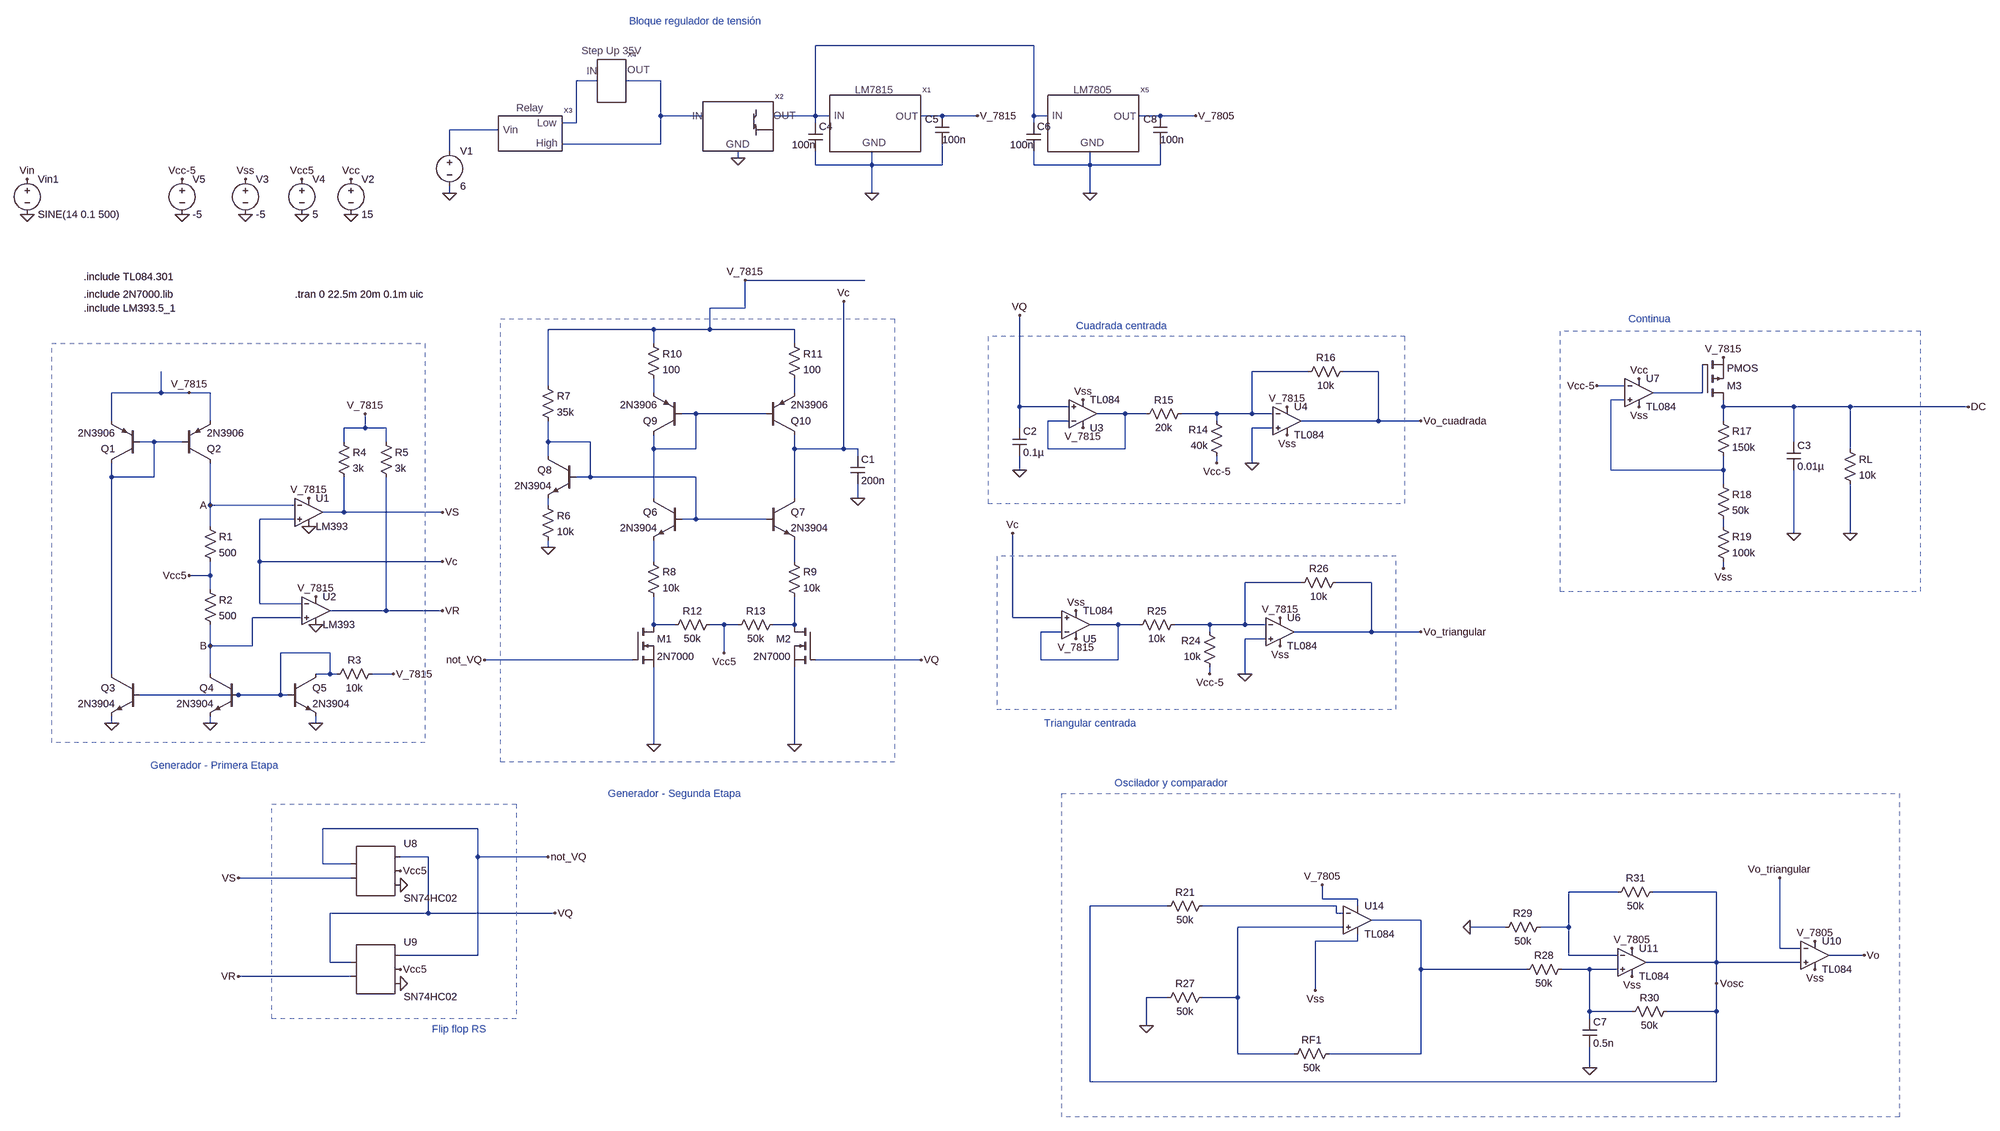
[diagram p0: schematic PWM.asc]
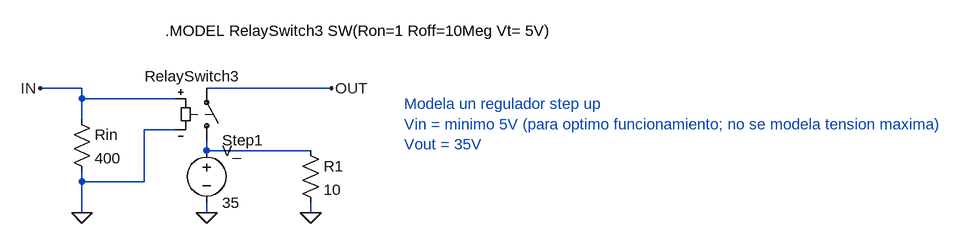
[diagram p1: sub-circuit stepup_ideal.asc]
PWM.asc, the LTspice schematic file:
Version 4
SHEET 1 4360 2064
WIRE 1584 -832 1088 -832
WIRE 592 -752 544 -752
WIRE 736 -752 656 -752
WIRE 736 -672 736 -752
WIRE 832 -672 736 -672
WIRE 1088 -672 1088 -832
WIRE 1088 -672 992 -672
WIRE 1120 -672 1088 -672
WIRE 1376 -672 1328 -672
WIRE 1456 -672 1376 -672
WIRE 1584 -672 1584 -832
WIRE 1616 -672 1584 -672
WIRE 1872 -672 1824 -672
WIRE 1952 -672 1872 -672
WIRE 544 -656 544 -752
WIRE 544 -656 512 -656
WIRE 1088 -656 1088 -672
WIRE 1584 -656 1584 -672
WIRE 368 -640 256 -640
WIRE 736 -608 736 -672
WIRE 736 -608 512 -608
WIRE 256 -592 256 -640
WIRE 912 -576 912 -592
WIRE 1088 -560 1088 -592
WIRE 1216 -560 1216 -592
WIRE 1216 -560 1088 -560
WIRE 1376 -560 1376 -608
WIRE 1376 -560 1216 -560
WIRE 1584 -560 1584 -592
WIRE 1712 -560 1712 -592
WIRE 1712 -560 1584 -560
WIRE 1872 -560 1872 -608
WIRE 1872 -560 1712 -560
WIRE 256 -496 256 -512
WIRE 1216 -496 1216 -560
WIRE 1712 -496 1712 -560
WIRE 1200 -288 928 -288
WIRE 928 -224 928 -288
WIRE 928 -224 848 -224
WIRE 720 -176 480 -176
WIRE 848 -176 848 -224
WIRE 848 -176 720 -176
WIRE 1040 -176 848 -176
WIRE 720 -144 720 -176
WIRE 1040 -144 1040 -176
WIRE 2208 -80 2080 -80
WIRE 2368 -80 2288 -80
WIRE 480 -48 480 -176
WIRE 2928 -48 2864 -48
WIRE -400 -32 -400 -80
WIRE -400 -32 -512 -32
WIRE -336 -32 -400 -32
WIRE -288 -32 -336 -32
WIRE 720 -32 720 -64
WIRE 1040 -32 1040 -64
WIRE 3104 -32 3104 -96
WIRE 3104 -32 2992 -32
WIRE 2928 -16 2896 -16
WIRE 1552 0 1552 -208
WIRE 1664 0 1552 0
WIRE 3152 0 3152 -16
WIRE 3312 0 3152 0
WIRE 3440 0 3312 0
WIRE 3712 0 3440 0
WIRE 816 16 784 16
WIRE 976 16 816 16
WIRE 1792 16 1728 16
WIRE 1840 16 1792 16
WIRE 2000 16 1920 16
WIRE 2080 16 2080 -80
WIRE 2080 16 2000 16
WIRE 2128 16 2080 16
WIRE -512 32 -512 -32
WIRE -288 32 -288 -32
WIRE 1664 32 1616 32
WIRE 2000 32 2000 16
WIRE 2368 32 2368 -80
WIRE 2368 32 2192 32
WIRE 2464 32 2368 32
WIRE 3152 32 3152 0
WIRE 64 48 64 16
WIRE 64 48 16 48
WIRE 112 48 64 48
WIRE 1552 48 1552 0
WIRE 2128 48 2080 48
WIRE -416 80 -448 80
WIRE -352 80 -416 80
WIRE 16 80 16 48
WIRE 112 80 112 48
WIRE 480 80 480 32
WIRE 576 80 480 80
WIRE 3312 80 3312 0
WIRE 720 96 720 64
WIRE 816 96 816 16
WIRE 816 96 720 96
WIRE 1040 96 1040 64
WIRE 1152 96 1152 -240
WIRE 1152 96 1040 96
WIRE 1184 96 1152 96
WIRE 1616 96 1616 32
WIRE 1792 96 1792 16
WIRE 1792 96 1616 96
WIRE 3440 96 3440 0
WIRE 480 112 480 80
WIRE 1184 112 1184 96
WIRE 2000 128 2000 112
WIRE 2080 128 2080 48
WIRE 1552 144 1552 112
WIRE 2896 144 2896 -16
WIRE 3152 144 3152 112
WIRE 3152 144 2896 144
WIRE -512 160 -512 128
WIRE -416 160 -416 80
WIRE -416 160 -512 160
WIRE 576 160 576 80
WIRE 576 160 544 160
WIRE 816 160 576 160
WIRE 3152 176 3152 144
WIRE 720 208 720 96
WIRE 1040 208 1040 96
WIRE 1184 208 1184 176
WIRE -288 224 -288 128
WIRE -96 224 -288 224
WIRE 480 224 480 208
WIRE 16 240 16 160
WIRE 16 240 -32 240
WIRE 240 240 16 240
WIRE -96 256 -176 256
WIRE 816 256 816 160
WIRE 816 256 784 256
WIRE 976 256 816 256
WIRE -288 272 -288 224
WIRE 3152 272 3152 256
WIRE 3312 288 3312 144
WIRE 3440 288 3440 176
WIRE 480 320 480 304
WIRE -176 352 -176 256
WIRE 240 352 -176 352
WIRE 720 352 720 304
WIRE 1040 352 1040 304
WIRE 3152 368 3152 352
WIRE -288 384 -288 352
WIRE -288 384 -336 384
WIRE 2192 400 2064 400
WIRE 2352 400 2272 400
WIRE -288 416 -288 384
WIRE -176 448 -176 352
WIRE -80 448 -176 448
WIRE 112 464 112 160
WIRE 112 464 -16 464
WIRE 240 464 112 464
WIRE -80 480 -192 480
WIRE 1536 480 1536 288
WIRE 1648 480 1536 480
WIRE 720 496 720 432
WIRE 768 496 720 496
WIRE 880 496 848 496
WIRE 912 496 880 496
WIRE 1040 496 1040 432
WIRE 1040 496 992 496
WIRE 1776 496 1712 496
WIRE 1824 496 1776 496
WIRE 1984 496 1904 496
WIRE 2064 496 2064 400
WIRE 2064 496 1984 496
WIRE 2112 496 2064 496
WIRE 1648 512 1600 512
WIRE 1984 512 1984 496
WIRE 2352 512 2352 400
WIRE 2352 512 2176 512
WIRE 2464 512 2352 512
WIRE 2112 528 2064 528
WIRE -288 544 -288 496
WIRE -192 544 -192 480
WIRE -192 544 -288 544
WIRE -16 560 -128 560
WIRE 880 560 880 496
WIRE 672 576 336 576
WIRE 1328 576 1088 576
WIRE 1600 576 1600 512
WIRE 1776 576 1776 496
WIRE 1776 576 1600 576
WIRE -512 608 -512 160
WIRE -288 608 -288 544
WIRE -16 608 -16 560
WIRE -16 608 -48 608
WIRE 0 608 -16 608
WIRE 128 608 80 608
WIRE 1984 608 1984 592
WIRE 2064 608 2064 528
WIRE -224 656 -448 656
WIRE -128 656 -128 560
WIRE -128 656 -224 656
WIRE -112 656 -128 656
WIRE -512 720 -512 704
WIRE -288 720 -288 704
WIRE -48 720 -48 704
WIRE 720 768 720 592
WIRE 1040 768 1040 592
WIRE 320 960 -32 960
WIRE 208 1024 144 1024
WIRE 320 1024 320 960
WIRE 480 1024 320 1024
WIRE -32 1040 -32 960
WIRE 32 1040 -32 1040
WIRE 32 1072 -224 1072
WIRE 2912 1104 2800 1104
WIRE 3136 1104 2992 1104
WIRE 2240 1120 2240 1088
WIRE 2320 1120 2240 1120
WIRE 1888 1136 1712 1136
WIRE 2272 1136 1968 1136
WIRE 2320 1136 2320 1120
WIRE 208 1152 208 1024
WIRE 208 1152 -16 1152
WIRE 496 1152 208 1152
WIRE 2272 1152 2272 1136
WIRE 2288 1152 2272 1152
WIRE 2464 1168 2352 1168
WIRE 2288 1184 2048 1184
WIRE 2656 1184 2576 1184
WIRE 2800 1184 2800 1104
WIRE 2800 1184 2736 1184
WIRE 2320 1216 2320 1200
WIRE 2320 1216 2224 1216
WIRE 3280 1232 3280 1072
WIRE 3328 1232 3280 1232
WIRE 320 1248 320 1024
WIRE 320 1248 144 1248
WIRE 2800 1248 2800 1184
WIRE 2912 1248 2800 1248
WIRE 3472 1248 3392 1248
WIRE -16 1264 -16 1152
WIRE 32 1264 -16 1264
WIRE 3136 1264 3136 1104
WIRE 3136 1264 2976 1264
WIRE 3328 1264 3136 1264
WIRE 2464 1280 2464 1168
WIRE 2704 1280 2464 1280
WIRE 2848 1280 2784 1280
WIRE 2912 1280 2848 1280
WIRE 32 1296 -224 1296
WIRE 3136 1312 3136 1264
WIRE 2224 1328 2224 1216
WIRE 1888 1344 1840 1344
WIRE 2048 1344 2048 1184
WIRE 2048 1344 1968 1344
WIRE 2848 1376 2848 1280
WIRE 2944 1376 2848 1376
WIRE 3136 1376 3136 1312
WIRE 3136 1376 3024 1376
WIRE 2848 1392 2848 1376
WIRE 1840 1408 1840 1344
WIRE 2048 1472 2048 1344
WIRE 2176 1472 2048 1472
WIRE 2464 1472 2464 1280
WIRE 2464 1472 2256 1472
WIRE 2848 1504 2848 1456
WIRE 1712 1536 1712 1136
WIRE 3136 1536 3136 1376
WIRE 3136 1536 1712 1536
FLAG -48 720 0
FLAG -288 720 0
FLAG -512 720 0
FLAG 480 320 0
FLAG 1184 208 0
FLAG 880 560 Vcc5
FLAG 1040 768 0
FLAG 720 768 0
FLAG 240 240 VS
FLAG 240 464 VR
FLAG -336 384 Vcc5
FLAG 240 352 Vc
FLAG 1328 576 VQ
FLAG 336 576 not_VQ
FLAG 1152 -240 Vc
FLAG 32 -528 Vcc
FLAG -208 -528 Vss
FLAG -208 -448 0
FLAG 32 -448 0
FLAG -80 -528 Vcc5
FLAG -80 -448 0
FLAG -352 -448 0
FLAG -352 -528 Vcc-5
FLAG -704 -528 Vin
FLAG -704 -448 0
FLAG -64 272 0
FLAG -48 496 0
FLAG -288 224 A
FLAG -288 544 B
FLAG 1696 -16 Vss
FLAG 1552 144 0
FLAG 2000 128 Vcc-5
FLAG 2080 128 0
FLAG 1552 -208 VQ
FLAG 2464 32 Vo_cuadrada
FLAG 2160 64 Vss
FLAG 1680 464 Vss
FLAG 1984 608 Vcc-5
FLAG 2064 608 0
FLAG 1536 288 Vc
FLAG 2464 512 Vo_triangular
FLAG 2144 544 Vss
FLAG -224 1072 VS
FLAG -224 1296 VR
FLAG 144 1280 Vcc5
FLAG 144 1312 0
FLAG 144 1088 0
FLAG 144 1056 Vcc5
FLAG 496 1152 VQ
FLAG 480 1024 not_VQ
FLAG 2864 -48 Vcc-5
FLAG 3312 288 0
FLAG 3712 0 DC
FLAG 2960 -64 Vcc
FLAG 2960 0 Vss
FLAG 3152 368 Vss
FLAG 3440 288 0
FLAG 1216 -496 0
FLAG 928 -288 V_7815
FLAG -336 -32 V_7815
FLAG -64 208 V_7815
FLAG -48 432 V_7815
FLAG 1696 48 V_7815
FLAG 2160 0 V_7815
FLAG 1680 528 V_7815
FLAG 2144 480 V_7815
FLAG 3152 -112 V_7815
FLAG 128 608 V_7815
FLAG 256 -496 0
FLAG 64 16 V_7815
FLAG 912 -576 0
FLAG 1456 -672 V_7815
FLAG 3360 1280 Vss
FLAG 3472 1248 Vo
FLAG 3280 1072 Vo_triangular
FLAG 1840 1408 0
FLAG 2224 1328 Vss
FLAG 2576 1184 0
FLAG 2848 1504 0
FLAG 2944 1296 Vss
FLAG 3136 1312 Vosc
FLAG 1712 -496 0
FLAG 1952 -672 V_7805
FLAG 2240 1088 V_7805
FLAG 2944 1232 V_7805
FLAG 3360 1216 V_7805
SYMBOL pnp -352 128 M180
SYMATTR InstName Q2
SYMATTR Value 2N3906
SYMBOL pnp -448 128 R180
SYMATTR InstName Q1
SYMATTR Value 2N3906
SYMBOL npn -448 608 M0
SYMATTR InstName Q3
SYMATTR Value 2N3904
SYMBOL res -304 256 R0
SYMATTR InstName R1
SYMATTR Value 500
SYMBOL res -304 400 R0
SYMATTR InstName R2
SYMATTR Value 500
SYMBOL npn -224 608 M0
SYMATTR InstName Q4
SYMATTR Value 2N3904
SYMBOL npn -112 608 R0
SYMATTR InstName Q5
SYMATTR Value 2N3904
SYMBOL res 96 592 R90
WINDOW 0 0 56 VBottom 2
WINDOW 3 32 56 VTop 2
SYMATTR InstName R3
SYMATTR Value 10k
SYMBOL res 864 480 R90
WINDOW 0 0 56 VBottom 2
WINDOW 3 32 56 VTop 2
SYMATTR InstName R12
SYMATTR Value 50k
SYMBOL res 1008 480 R90
WINDOW 0 0 56 VBottom 2
WINDOW 3 32 56 VTop 2
SYMATTR InstName R13
SYMATTR Value 50k
SYMBOL npn 976 208 R0
SYMATTR InstName Q7
SYMATTR Value 2N3904
SYMBOL npn 784 208 M0
SYMATTR InstName Q6
SYMATTR Value 2N3904
SYMBOL npn 544 112 M0
SYMATTR InstName Q8
SYMATTR Value 2N3904
SYMBOL res 464 208 R0
SYMATTR InstName R6
SYMATTR Value 10k
SYMBOL res 464 -64 R0
SYMATTR InstName R7
SYMATTR Value 35k
SYMBOL cap 1168 112 R0
SYMATTR InstName C1
SYMATTR Value 200n
SYMBOL pnp 784 64 R180
SYMATTR InstName Q9
SYMATTR Value 2N3906
SYMBOL pnp 976 64 M180
SYMATTR InstName Q10
SYMATTR Value 2N3906
SYMBOL voltage 32 -544 R0
WINDOW 123 0 0 Left 2
WINDOW 39 0 0 Left 2
SYMATTR InstName V2
SYMATTR Value 15
SYMBOL voltage -208 -544 R0
WINDOW 123 0 0 Left 2
WINDOW 39 0 0 Left 2
SYMATTR InstName V3
SYMATTR Value -5
SYMBOL voltage -80 -544 R0
WINDOW 123 0 0 Left 2
WINDOW 39 0 0 Left 2
SYMATTR InstName V4
SYMATTR Value 5
SYMBOL voltage -352 -544 R0
WINDOW 123 0 0 Left 2
WINDOW 39 0 0 Left 2
SYMATTR InstName V5
SYMATTR Value -5
SYMBOL voltage -704 -544 R0
WINDOW 123 0 0 Left 2
WINDOW 39 0 0 Left 2
SYMATTR InstName Vin1
SYMATTR Value SINE(14 0.1 500)
SYMBOL opamp2 -48 400 R0
SYMATTR InstName U2
SYMATTR Value LM393
SYMBOL opamp2 -64 176 R0
SYMATTR InstName U1
SYMATTR Value LM393
SYMBOL res 704 336 R0
SYMATTR InstName R8
SYMATTR Value 10k
SYMBOL res 1024 336 R0
SYMATTR InstName R9
SYMATTR Value 10k
SYMBOL res 1024 -160 R0
SYMATTR InstName R11
SYMATTR Value 100
SYMBOL res 704 -160 R0
SYMATTR InstName R10
SYMATTR Value 100
SYMBOL res 0 64 R0
SYMATTR InstName R4
SYMATTR Value 3k
SYMBOL res 96 64 R0
SYMATTR InstName R5
SYMATTR Value 3k
SYMBOL cap 1536 48 R0
SYMATTR InstName C2
SYMATTR Value 0.1µ
SYMBOL res 2016 128 R180
WINDOW 0 36 76 Left 2
WINDOW 3 36 40 Left 2
SYMATTR InstName R14
SYMATTR Value 40k
SYMBOL res 1936 0 R90
WINDOW 0 0 56 VBottom 2
WINDOW 3 32 56 VTop 2
SYMATTR InstName R15
SYMATTR Value 20k
SYMBOL res 2304 -96 R90
WINDOW 0 0 56 VBottom 2
WINDOW 3 32 56 VTop 2
SYMATTR InstName R16
SYMATTR Value 10k
SYMBOL opamp2 1696 80 M180
SYMATTR InstName U3
SYMATTR Value TL084
SYMBOL opamp2 2160 -32 R0
SYMATTR InstName U4
SYMATTR Value TL084
SYMBOL res 2000 608 R180
WINDOW 0 36 76 Left 2
WINDOW 3 36 40 Left 2
SYMATTR InstName R24
SYMATTR Value 10k
SYMBOL res 1920 480 R90
WINDOW 0 0 56 VBottom 2
WINDOW 3 32 56 VTop 2
SYMATTR InstName R25
SYMATTR Value 10k
SYMBOL res 2288 384 R90
WINDOW 0 0 56 VBottom 2
WINDOW 3 32 56 VTop 2
SYMATTR InstName R26
SYMATTR Value 10k
SYMBOL opamp2 1680 560 M180
SYMATTR InstName U5
SYMATTR Value TL084
SYMBOL opamp2 2144 448 R0
SYMATTR InstName U6
SYMATTR Value TL084
SYMBOL nmos 672 496 R0
SYMATTR InstName M1
SYMATTR Value 2N7000
SYMATTR Prefix X
SYMBOL nmos 1088 496 M0
SYMATTR InstName M2
SYMATTR Value 2N7000
SYMATTR Prefix X
SYMBOL cap 3296 80 R0
SYMATTR InstName C3
SYMATTR Value 0.01µ
SYMBOL res 3136 16 R0
SYMATTR InstName R17
SYMATTR Value 150k
SYMBOL res 3136 160 R0
SYMATTR InstName R18
SYMATTR Value 50k
SYMBOL pmos 3104 -16 M180
SYMATTR InstName M3
SYMBOL opamp2 2960 -96 R0
SYMATTR InstName U7
SYMATTR Value TL084
SYMBOL res 3136 256 R0
SYMATTR InstName R19
SYMATTR Value 100k
SYMBOL AutoGenerated/SN74HC02 80 1056 R0
SYMATTR InstName U8
SYMBOL AutoGenerated/SN74HC02 80 1280 R0
SYMATTR InstName U9
SYMBOL res 3424 80 R0
SYMATTR InstName RL
SYMATTR Value 10k
SYMBOL LM7815 1200 -688 R0
SYMATTR InstName X1
SYMBOL cap 1072 -656 R0
WINDOW 3 -38 50 Left 2
SYMATTR Value 100n
SYMATTR InstName C4
SYMBOL cap 1392 -608 R180
WINDOW 0 24 56 Left 2
WINDOW 3 -38 10 Left 2
SYMATTR InstName C5
SYMATTR Value 100n
SYMBOL RegDePotencia 912 -656 R0
SYMATTR InstName X2
SYMBOL voltage 256 -608 R0
WINDOW 123 0 0 Left 0
WINDOW 39 0 0 Left 0
SYMATTR InstName V1
SYMATTR Value 6
SYMBOL Relay 432 -640 R0
SYMATTR InstName X3
SYMBOL StepUp_ideal 624 -768 R0
SYMATTR InstName X4
SYMBOL opamp2 3360 1184 R0
SYMATTR InstName U10
SYMATTR Value TL084
SYMBOL res 1984 1120 R90
WINDOW 0 0 56 VBottom 2
WINDOW 3 32 56 VTop 2
SYMATTR InstName R21
SYMATTR Value 50k
SYMBOL res 1984 1328 R90
WINDOW 0 0 56 VBottom 2
WINDOW 3 32 56 VTop 2
SYMATTR InstName R27
SYMATTR Value 50k
SYMBOL res 2272 1456 R90
WINDOW 0 0 56 VBottom 2
WINDOW 3 32 56 VTop 2
SYMATTR InstName RF1
SYMATTR Value 50k
SYMBOL res 2688 1296 R270
WINDOW 0 32 56 VTop 2
WINDOW 3 0 56 VBottom 2
SYMATTR InstName R28
SYMATTR Value 50k
SYMBOL res 2752 1168 R90
WINDOW 0 0 56 VBottom 2
WINDOW 3 32 56 VTop 2
SYMATTR InstName R29
SYMATTR Value 50k
SYMBOL res 3040 1360 R90
WINDOW 0 0 56 VBottom 2
WINDOW 3 32 56 VTop 2
SYMATTR InstName R30
SYMATTR Value 50k
SYMBOL cap 2832 1392 R0
SYMATTR InstName C7
SYMATTR Value 0.5n
SYMBOL res 3008 1088 R90
WINDOW 0 0 56 VBottom 2
WINDOW 3 32 56 VTop 2
SYMATTR InstName R31
SYMATTR Value 50k
SYMBOL opamp2 2944 1200 R0
SYMATTR InstName U11
SYMATTR Value TL084
SYMBOL opamp2 2320 1104 R0
SYMATTR InstName U14
SYMATTR Value TL084
SYMBOL cap 1568 -656 R0
WINDOW 3 -38 50 Left 2
SYMATTR Value 100n
SYMATTR InstName C6
SYMBOL cap 1888 -608 R180
WINDOW 0 24 56 Left 2
WINDOW 3 -38 10 Left 2
SYMATTR InstName C8
SYMATTR Value 100n
SYMBOL LM7805 1696 -688 R0
SYMATTR InstName X5
TEXT -424 816 Left 2 ;Generador - Primera Etapa
TEXT 616 880 Left 2 ;Generador - Segunda Etapa
TEXT -96 -256 Left 2 !.tran 0 22.5m 20m 0.1m uic
TEXT -576 -296 Left 2 !.include TL084.301
TEXT -576 -224 Left 2 !.include LM393.5_1
TEXT 1608 720 Left 2 ;Triangular centrada
TEXT 1680 -184 Left 2 ;Cuadrada centrada
TEXT 216 1416 Left 2 ;Flip flop RS
TEXT -576 -256 Left 2 !.include 2N7000.lib
TEXT 2936 -200 Left 2 ;Continua
TEXT 664 -888 Left 2 ;Bloque regulador de tensión
TEXT 1768 856 Left 2 ;Oscilador y comparador
RECTANGLE Normal 372 -200 1268 808 2
RECTANGLE Normal -648 -144 200 764 2
RECTANGLE Normal -148 904 408 1392 2
RECTANGLE Normal 3600 -172 2780 420 2
RECTANGLE Normal 2428 -160 1480 220 2
RECTANGLE Normal 2408 340 1500 688 2
RECTANGLE Normal 3552 1616 1648 880 2

stepup_ideal.asc, the sub-circuit schematic file:
Version 4
SHEET 1 1424 680
WIRE 48 64 -16 64
WIRE 432 64 240 64
WIRE 48 80 48 64
WIRE 192 80 48 80
WIRE 48 112 48 80
WIRE 192 128 144 128
WIRE 240 160 240 144
WIRE 400 160 240 160
WIRE 48 208 48 192
WIRE 144 208 144 128
WIRE 144 208 48 208
WIRE 48 256 48 208
WIRE 240 256 240 240
WIRE 400 256 400 240
FLAG -16 64 IN
FLAG 432 64 OUT
FLAG 48 256 0
FLAG 240 256 0
FLAG 400 256 0
SYMBOL voltage 240 144 R0
WINDOW 123 0 0 Left 0
WINDOW 39 0 0 Left 0
SYMATTR InstName V_
SYMATTR Value 35
SYMBOL sw 240 160 M180
WINDOW 3 -95 114 Left 2
SYMATTR Value RelaySwitch3
SYMATTR InstName Step1
SYMBOL res 32 96 R0
SYMATTR InstName Rin
SYMATTR Value 400
SYMBOL res 384 144 R0
SYMATTR InstName R1
SYMATTR Value 10
TEXT 176 -24 Left 2 !.MODEL RelaySwitch3 SW(Ron=1 Roff=10Meg Vt= 5V)
TEXT 544 88 Left 2 ;Modela un regulador step up\nVin = minimo 5V (para optimo funcionamiento; no se modela tension maxima)\nVout = 35V

The netlist it stands for:
* PWM.asc
Q2 A N012 V_7815 0 2N3906
Q1 N012 N012 V_7815 0 2N3906
Q3 N012 N022 0 0 2N3904
R1 A Vcc5 500
R2 Vcc5 B 500
Q4 B N022 0 0 2N3904
Q5 N022 N022 0 0 2N3904
R3 V_7815 N022 10k
R12 Vcc5 N019 50k
R13 N020 Vcc5 50k
Q7 Vc N013 N017 0 2N3904
Q6 N010 N013 N016 0 2N3904
Q8 N013 N013 N014 0 2N3904
R6 N014 0 10k
R7 V_7815 N013 35k
C1 Vc 0 200n
Q9 N010 N010 N006 0 2N3906
Q10 Vc N010 N007 0 2N3906
V2 Vcc 0 15
V3 Vss 0 -5
V4 Vcc5 0 5
V5 Vcc-5 0 -5
Vin1 Vin 0 SINE(14 0.1 500)
XU2 B Vc V_7815 0 VR LM393  ; pins In+ In- V+ V- OUT
XU1 Vc A V_7815 0 VS LM393  ; pins In+ In- V+ V- OUT
R8 N016 N019 10k
R9 N017 N020 10k
R11 V_7815 N007 100
R10 V_7815 N006 100
R4 V_7815 VS 3k
R5 V_7815 VR 3k
C2 VQ 0 0.1µ
R14 Vcc-5 N005 40k
R15 N005 N011 20k
R16 Vo_cuadrada N005 10k
XU3 VQ N011 V_7815 Vss N011 TL084  ; pins In+ In- V+ V- OUT
XU4 0 N005 V_7815 Vss Vo_cuadrada TL084  ; pins In+ In- V+ V- OUT
R24 Vcc-5 N018 10k
R25 N018 N021 10k
R26 Vo_triangular N018 10k
XU5 Vc N021 V_7815 Vss N021 TL084  ; pins In+ In- V+ V- OUT
XU6 0 N018 V_7815 Vss Vo_triangular TL084  ; pins In+ In- V+ V- OUT
XM1 N019 not_VQ 0 2N7000  ; pins D G S
XM2 N020 VQ 0 2N7000  ; pins D G S
C3 DC 0 0.01µ
R17 DC N009 150k
R18 N009 N015 50k
M3 DC N008 V_7815 V_7815 PMOS
XU7 N009 Vcc-5 Vcc Vss N008 TL084  ; pins In+ In- V+ V- OUT
R19 N015 Vss 100k
* U8: SN74HC02 (symbol AutoGenerated/SN74HC02 not available, pins judged from their places): pin1=not_VQ pin2=VS pin3=VQ pin4=Vcc5 pin5=0
* U9: SN74HC02 (symbol AutoGenerated/SN74HC02 not available, pins judged from their places): pin1=VQ pin2=VR pin3=not_VQ pin4=Vcc5 pin5=0
RL DC 0 10k
XX1 N001 V_7815 0 LM7815  ; pins IN OUT Ground
C4 N001 0 100n
C5 0 V_7815 100n
XX2 N003 N001 0 RegDePotencia  ; pins IN OUT ground
V1 N004 0 6
XX3 N004 N002 N003 Relay  ; pins IN LOW HIGH
XX4 N002 N003 stepup_ideal
XU10 Vosc Vo_triangular V_7805 Vss Vo TL084  ; pins In+ In- V+ V- OUT
R21 N024 Vosc 50k
R27 N026 0 50k
RF1 N025 N026 50k
R28 N025 N027 50k
R29 N023 0 50k
R30 Vosc N027 50k
C7 N027 0 0.5n
R31 Vosc N023 50k
XU11 N027 N023 V_7805 Vss Vosc TL084  ; pins In+ In- V+ V- OUT
XU14 N026 N024 V_7805 Vss N025 TL084  ; pins In+ In- V+ V- OUT
C6 N001 0 100n
C8 0 V_7805 100n
XX5 N001 V_7805 0 LM7805  ; pins IN OUT Ground

* block symbol definitions
.subckt stepup_ideal IN OUT
V_ N001 0 35
Step1 N001 OUT IN 0 RelaySwitch3
Rin IN 0 400
R1 N001 0 10
.MODEL RelaySwitch3 SW(Ron=1 Roff=10Meg Vt= 5V)
* Modela un regulador step up
* Vin = minimo 5V (para optimo funcionamiento; no se modela tension maxima)
* Vout = 35V
.ends stepup_ideal

.model NPN NPN
.model PNP PNP
.lib standard.bjt
.model NMOS NMOS
.model PMOS PMOS
.lib standard.mos
* Generador - Primera Etapa
* Generador - Segunda Etapa
.tran 0 22.5m 20m 0.1m uic
.include TL084.301
.include LM393.5_1
* Triangular centrada
* Cuadrada centrada
* Flip flop RS
.include 2N7000.lib
* Continua
* Bloque regulador de tensión
* Oscilador y comparador
.backanno
.end